# Altium schematic sheet imxbbmmc.SchDoc: IMXBB
size A3; DocumentNumber: 6; Revision: 2.0; SheetNumber: 6; SheetTotal: 9
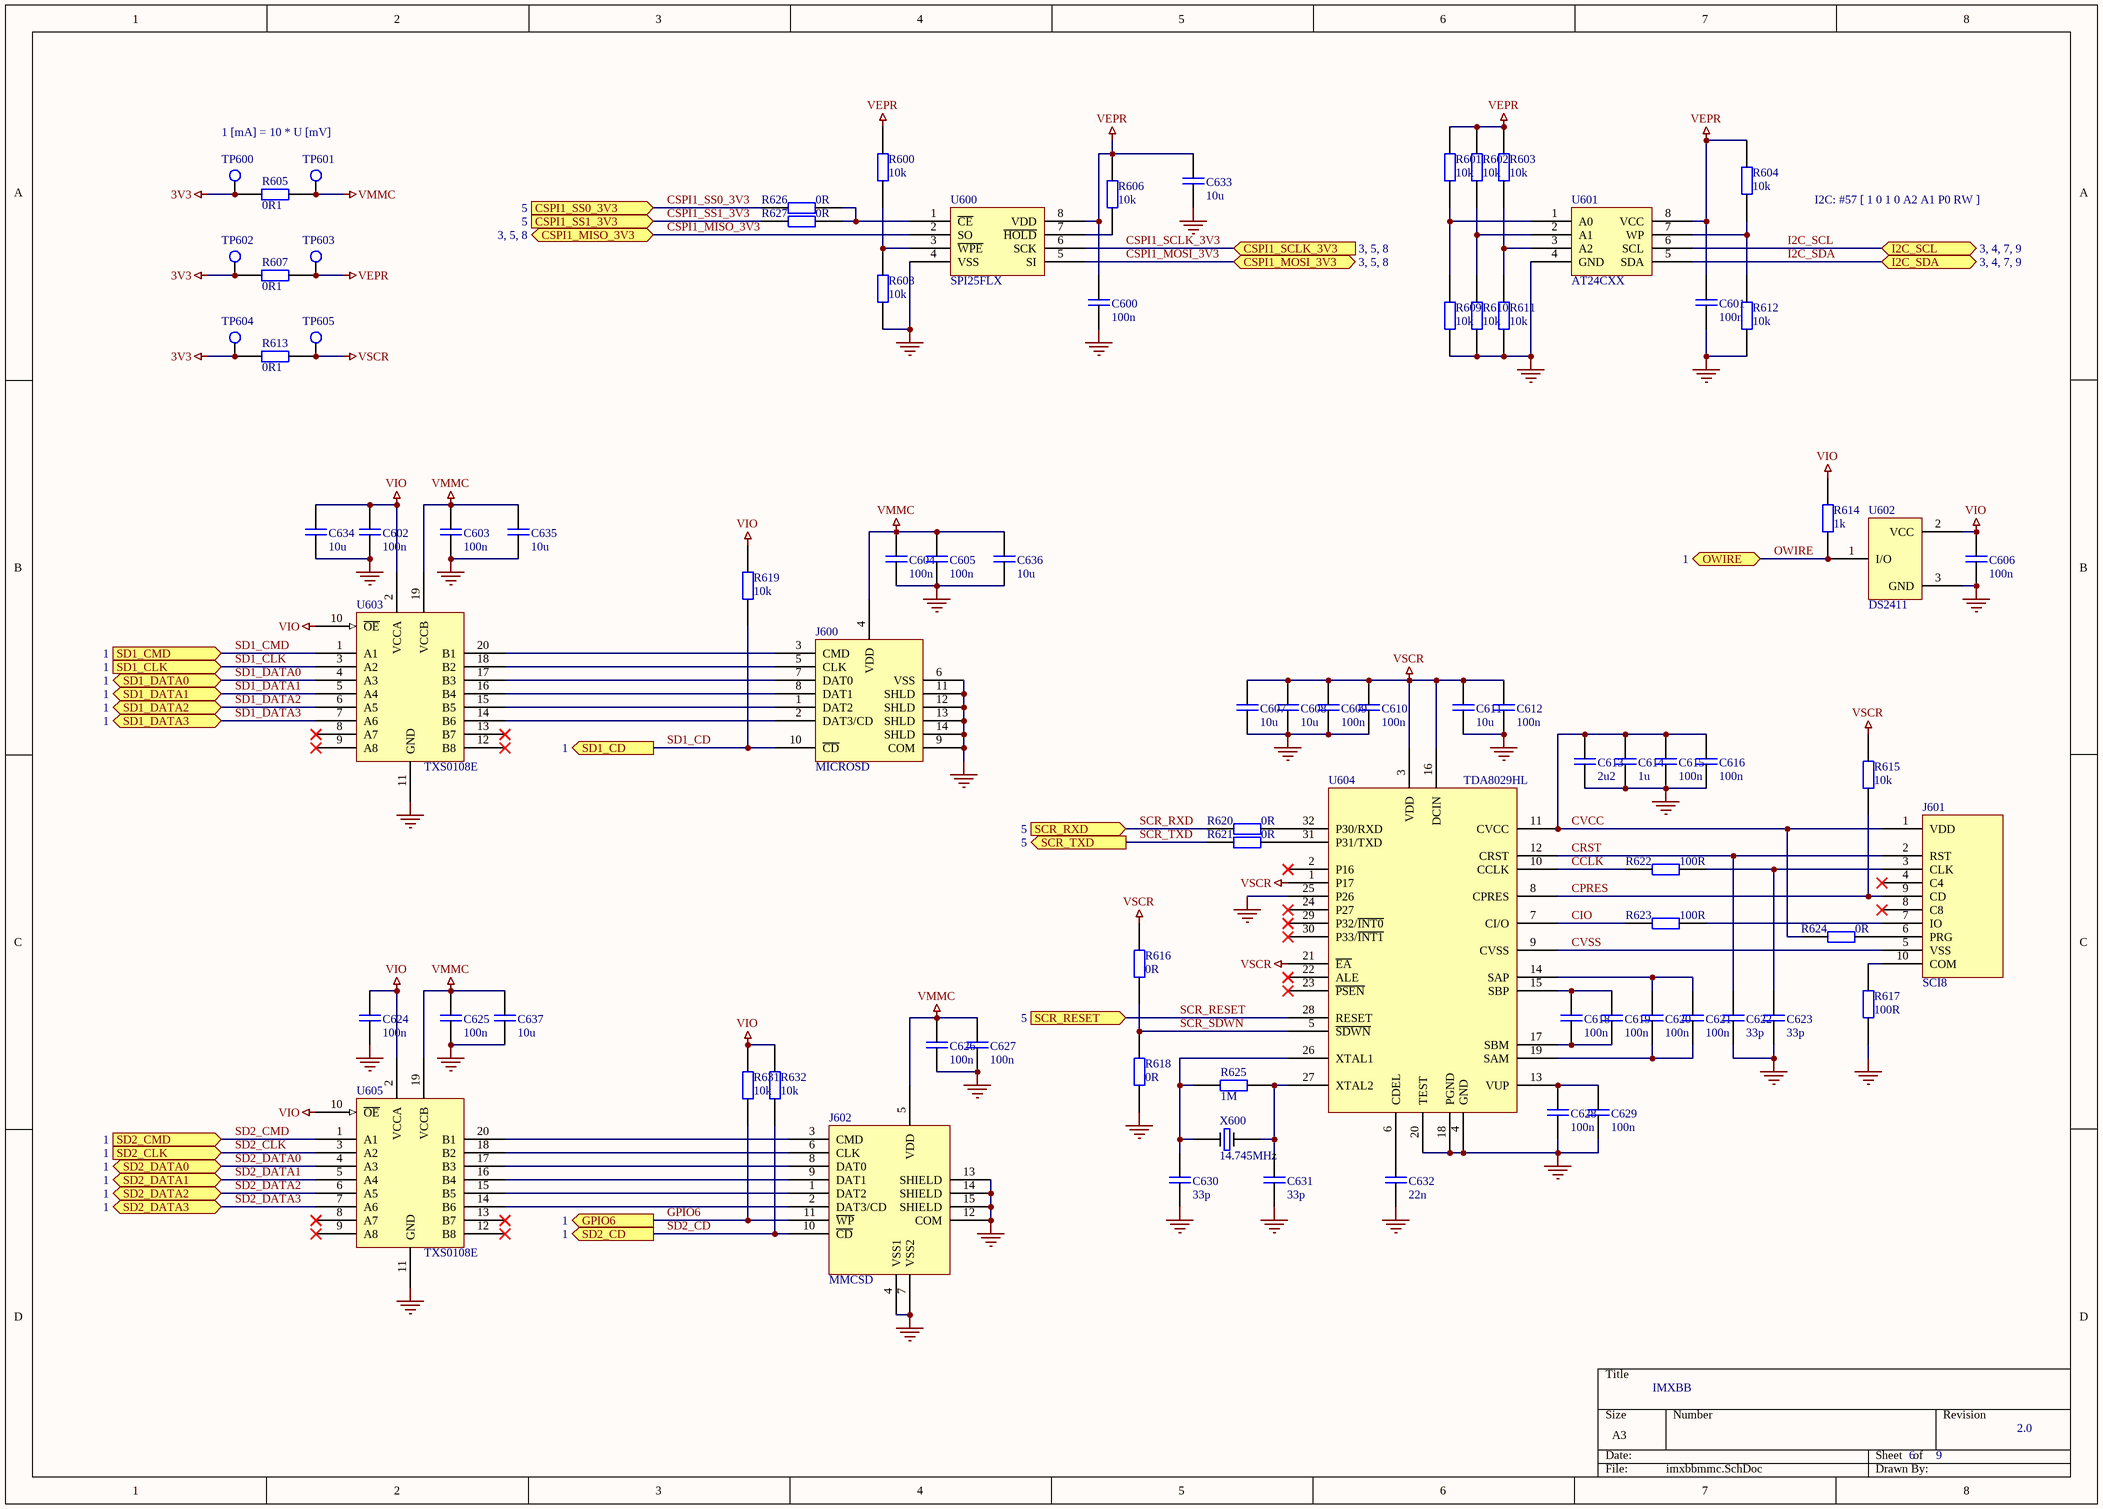
[diagram p0: imxbbmmc.SchDoc]

## Parts
C600  100n  [0603]
C601  100n  [0603]
C602  100n  [0603]
C603  100n  [0603]
C604  100n  [0603]
C605  100n  [0603]
C606  100n  [0603]
C607  10u  [0805]
C608  10u  [0805]
C609  100n  [0603]
C610  100n  [0603]
C611  10u  [0805]
C612  100n  [0603]
C613  2u2  [0603]
C614  1u  [0603]
C615  100n  [0603]
C616  100n  [0603]
C618  100n  [0603]
C619  100n  [0603]
C620  100n  [0603]
C621  100n  [0603]
C622  33p  [0603]
C623  33p  [0603]
C624  100n  [0603]
C625  100n  [0603]
C626  100n  [0603]
C627  100n  [0603]
C628  100n  [0603]
C629  100n  [0603]
C630  33p  [0603]
C631  33p  [0603]
C632  22n  [0603]
C633  10u  [0805]
C634  10u  [0805]
C635  10u  [0805]
C636  10u  [0805]
C637  10u  [0805]
J600  MICROSD  [uSD10]
J601  SCI8  [SCI8F]
J602  MMCSD  [SDCMF-109]
R600  10k  [0603]
R601  10k  [0603]
R602  10k  [0603]
R603  10k  [0603]
R604  10k  [0603]
R605  0R1  [0603]
R606  10k  [0603]
R607  0R1  [0603]
R608  10k  [0603]
R609  10k  [0603]
R610  10k  [0603]
R611  10k  [0603]
R612  10k  [0603]
R613  0R1  [0603]
R614  1k  [0603]
R615  10k  [0603]
R616  0R  [0603]
R617  100R  [0603]
R618  0R  [0603]
R619  10k  [0603]
R620  0R  [0603]
R621  0R  [0603]
R622  100R  [0603]
R623  100R  [0603]
R624  0R  [0603]
R625  1M  [0603]
R626  0R  [0603]
R627  0R  [0603]
R631  10k  [0603]
R632  10k  [0603]
TP600  TESTPOINT  [TESTPOINT_2mm]  (value not drawn)
TP601  TESTPOINT  [TESTPOINT_2mm]  (value not drawn)
TP602  TESTPOINT  [TESTPOINT_2mm]  (value not drawn)
TP603  TESTPOINT  [TESTPOINT_2mm]  (value not drawn)
TP604  TESTPOINT  [TESTPOINT_2mm]  (value not drawn)
TP605  TESTPOINT  [TESTPOINT_2mm]  (value not drawn)
U600  SPI25FLX  [SOIC8]
U601  AT24CXX  [SOIC8]
U602  DS2411  [SOT23]
U603  TXS0108E  [TSSOP20]
U604  TDA8029HL  [LQFP32]
U605  TXS0108E  [TSSOP20]
X600  14.745MHz  [HC494H]

## Ports
CSPI1_MISO_3V3 (bidir, see 3, 5, 8), CSPI1_MOSI_3V3 (bidir, see 3, 5, 8), CSPI1_SCLK_3V3 (in, see 3, 5, 8), CSPI1_SS0_3V3 (in, see 5), CSPI1_SS1_3V3 (in, see 5), GPIO6 (out, see 1), I2C_SCL (bidir, see 3, 4, 7, 9), I2C_SDA (bidir, see 3, 4, 7, 9), OWIRE (bidir, see 1), SCR_RESET (in, see 5), SCR_RXD (in, see 5), SCR_TXD (out, see 5), SD1_CD (out, see 1), SD1_CLK (in, see 1), SD1_CMD (in, see 1), SD1_DATA0 (bidir, see 1), SD1_DATA1 (bidir, see 1), SD1_DATA2 (bidir, see 1), SD1_DATA3 (bidir, see 1), SD2_CD (out, see 1), SD2_CLK (in, see 1), SD2_CMD (in, see 1), SD2_DATA0 (bidir, see 1), SD2_DATA1 (bidir, see 1), SD2_DATA2 (bidir, see 1), SD2_DATA3 (bidir, see 1)

## Nets
3V3: R605.1 R607.1 R613.1 TP600.1 TP602.1 TP604.1
GND: C600.1 C601.1 C602.1 C603.1 C604.1 C605.1 C606.1 C607.1 C608.1 C609.1 C610.1 C611.1 C612.1 C613.1 C614.1 C615.1 C616.1 C622.1 C623.1 C624.1 C625.1 C626.1 C627.1 C628.1 C629.1 C630.1 C631.1 C632.1 C633.1 C634.1 C635.1 C636.1 C637.1 J600.6(VSS) J600.9(COM) J600.11(SHLD) J600.12(SHLD) J600.13(SHLD) J600.14(SHLD) J602.4(VSS1) J602.7(VSS2) J602.12(COM) J602.13(SHIELD) J602.14(SHIELD) J602.15(SHIELD) R608.2 R609.2 R610.2 R611.2 R612.2 R617.1 R618.1 U600.4(VSS) U601.4(GND) U602.3(GND) U603.11(GND) U604.4(GND) U604.18(PGND) U604.20(TEST) U604.25(P26) U605.11(GND)
VEPR: C600.2 C601.2 C633.2 R600.1 R601.1 R602.1 R603.1 R604.1 R606.1 R607.2 TP603.1 U600.8(VDD) U601.8(VCC)
VIO: C602.2 C606.2 C624.2 C634.2 R614.1 R619.1 R631.1 R632.1 U602.2(VCC) U603.2(VCCA) U603.10(~{OE}) U605.2(VCCA) U605.10(~{OE})
VMMC: C603.2 C604.2 C605.2 C625.2 C626.2 C627.2 C635.2 C636.2 C637.2 J600.4(VDD) J602.5(VDD) R605.2 TP601.1 U603.19(VCCB) U605.19(VCCB)
VSCR: C607.2 C608.2 C609.2 C610.2 C611.2 C612.2 R613.2 R615.2 R616.2 TP605.1 U604.1(P17) U604.3(VDD) U604.16(DCIN) U604.21(~{EA})
CCLK: R622.1 U604.10(CCLK)
CIO: R623.1 U604.7(CI/O)
CPRES: J601.9(CD) R615.1 U604.8(CPRES)
CRST: C622.2 J601.2(RST) U604.12(CRST)
CSPI1_MISO_3V3: U600.2(SO) ; port CSPI1_MISO_3V3
CSPI1_MOSI_3V3: U600.5(SI) ; port CSPI1_MOSI_3V3
CSPI1_SCLK_3V3: U600.6(SCK) ; port CSPI1_SCLK_3V3
CSPI1_SS0_3V3: R626.1 ; port CSPI1_SS0_3V3
CSPI1_SS1_3V3: R627.1 ; port CSPI1_SS1_3V3
CVCC: C613.2 C614.2 C615.2 C616.2 J601.1(VDD) R624.1 U604.11(CVCC)
CVSS: J601.5(VSS) U604.9(CVSS)
GPIO6: J602.11(~{WP}) R631.2 ; port GPIO6
I2C_SCL: U601.6(SCL) ; port I2C_SCL
I2C_SDA: U601.5(SDA) ; port I2C_SDA
OWIRE: R614.2 U602.1(I/O) ; port OWIRE
SCR_RESET: U604.28(RESET) ; port SCR_RESET
SCR_RXD: R620.1 ; port SCR_RXD
SCR_SDWN: R616.1 R618.2 U604.5(~{SDWN})
SCR_TXD: R621.1 ; port SCR_TXD
SD1_CD: J600.10(~{CD}) R619.2 ; port SD1_CD
SD1_CLK: U603.3(A2) ; port SD1_CLK
SD1_CMD: U603.1(A1) ; port SD1_CMD
SD1_DATA0: U603.4(A3) ; port SD1_DATA0
SD1_DATA1: U603.5(A4) ; port SD1_DATA1
SD1_DATA2: U603.6(A5) ; port SD1_DATA2
SD1_DATA3: U603.7(A6) ; port SD1_DATA3
SD2_CD: J602.10(~{CD}) R632.2 ; port SD2_CD
SD2_CLK: U605.3(A2) ; port SD2_CLK
SD2_CMD: U605.1(A1) ; port SD2_CMD
SD2_DATA0: U605.4(A3) ; port SD2_DATA0
SD2_DATA1: U605.5(A4) ; port SD2_DATA1
SD2_DATA2: U605.6(A5) ; port SD2_DATA2
SD2_DATA3: U605.7(A6) ; port SD2_DATA3
NetC618_1: C618.1 C619.1 U604.17(SBM)
NetC618_2: C618.2 C619.2 U604.15(SBP)
NetC620_1: C620.1 C621.1 U604.19(SAM)
NetC620_2: C620.2 C621.2 U604.14(SAP)
NetC623_2: C623.2 J601.3(CLK) R622.2
NetC628_2: C628.2 C629.2 U604.13(VUP)
NetC630_2: C630.2 R625.2 U604.26(XTAL1) X600.1
NetC631_2: C631.2 R625.1 U604.27(XTAL2) X600.2
NetC632_2: C632.2 U604.6(CDEL)
NetJ600_1: J600.1(DAT2) U603.15(B5)
NetJ600_2: J600.2(DAT3/CD) U603.14(B6)
NetJ600_3: J600.3(CMD) U603.20(B1)
NetJ600_5: J600.5(CLK) U603.18(B2)
NetJ600_7: J600.7(DAT0) U603.17(B3)
NetJ600_8: J600.8(DAT1) U603.16(B4)
NetJ601_6: J601.6(PRG) R624.2
NetJ601_7: J601.7(IO) R623.2
NetJ601_10: J601.10(COM) R617.2
NetJ602_1: J602.1(DAT2) U605.15(B5)
NetJ602_2: J602.2(DAT3/CD) U605.14(B6)
NetJ602_3: J602.3(CMD) U605.20(B1)
NetJ602_6: J602.6(CLK) U605.18(B2)
NetJ602_8: J602.8(DAT0) U605.17(B3)
NetJ602_9: J602.9(DAT1) U605.16(B4)
NetR600_2: R600.2 R608.1 U600.3(~{WPE})
NetR601_2: R601.2 R609.1 U601.1(A0)
NetR602_2: R602.2 R610.1 U601.2(A1)
NetR603_2: R603.2 R611.1 U601.3(A2)
NetR604_2: R604.2 R612.1 U601.7(WP)
NetR606_2: R606.2 U600.7(~{HOLD})
NetR620_2: R620.2 U604.32(P30/RXD)
NetR621_2: R621.2 U604.31(P31/TXD)
NetR626_2: R626.2 R627.2 U600.1(~{CE})

Not connected (* = marked no-connect by the designer): J601 4(C4)* 8(C8)*; U603 8(A7)* 9(A8)* 12(B8)* 13(B7)*; U604 2(P16)* 22(ALE)* 23(~{PSEN})* 24(P27)* 29(P32/~{INT0})* 30(P33/~{INT1})*; U605 8(A7)* 9(A8)* 12(B8)* 13(B7)*

## Notes on the sheet
- 1 [mA] = 10 * U [mV]
- I2C: #57 [ 1 0 1 0 A2 A1 P0 RW ]

## Library data of the parts
C600-C616 C618-C637 = C
R600-R627 R631 R632 = R
TP600-TP605 = TESTPOINT: Testpoint pad; Order number: no component; Component class: TP; Producer: n/a; Assembly type: no component
X600 = XTAL